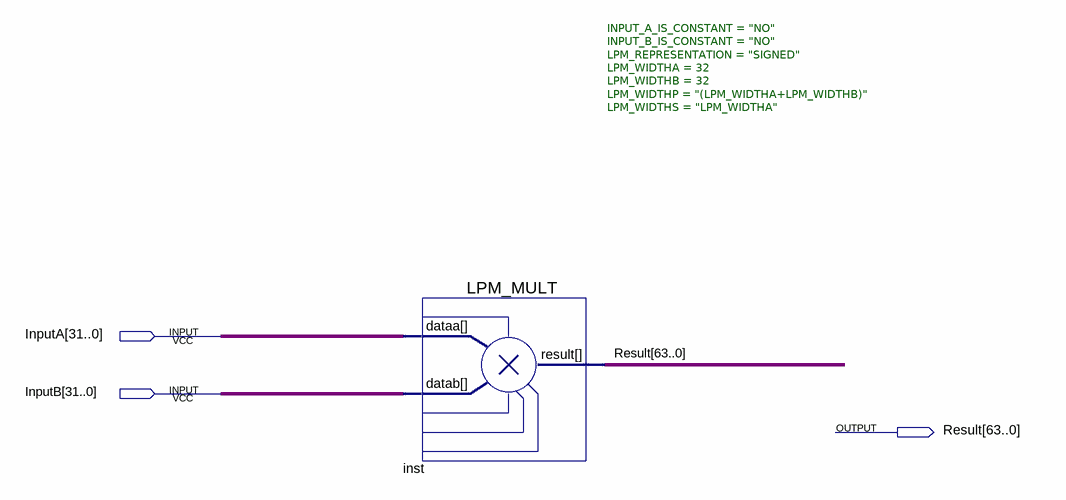
[diagram p0: schematic sheet]
// Quartus schematic TwoInputSigned32Mult.bdf as structural Verilog: 1 symbols, 3 pins
module TwoInputSigned32Mult (
  input  [31:0] InputA,
  input  [31:0] InputB,
  output [63:0] Result
);

  LPM_MULT #(.INPUT_A_IS_CONSTANT("NO"), .INPUT_B_IS_CONSTANT("NO"), .LPM_REPRESENTATION("SIGNED"), .LPM_WIDTHA(32), .LPM_WIDTHB(32), .LPM_WIDTHP("(LPM_WIDTHA+LPM_WIDTHB)"), .LPM_WIDTHS("LPM_WIDTHA")) inst (
    .dataa(InputA), .datab(InputB), .result(Result));
endmodule
